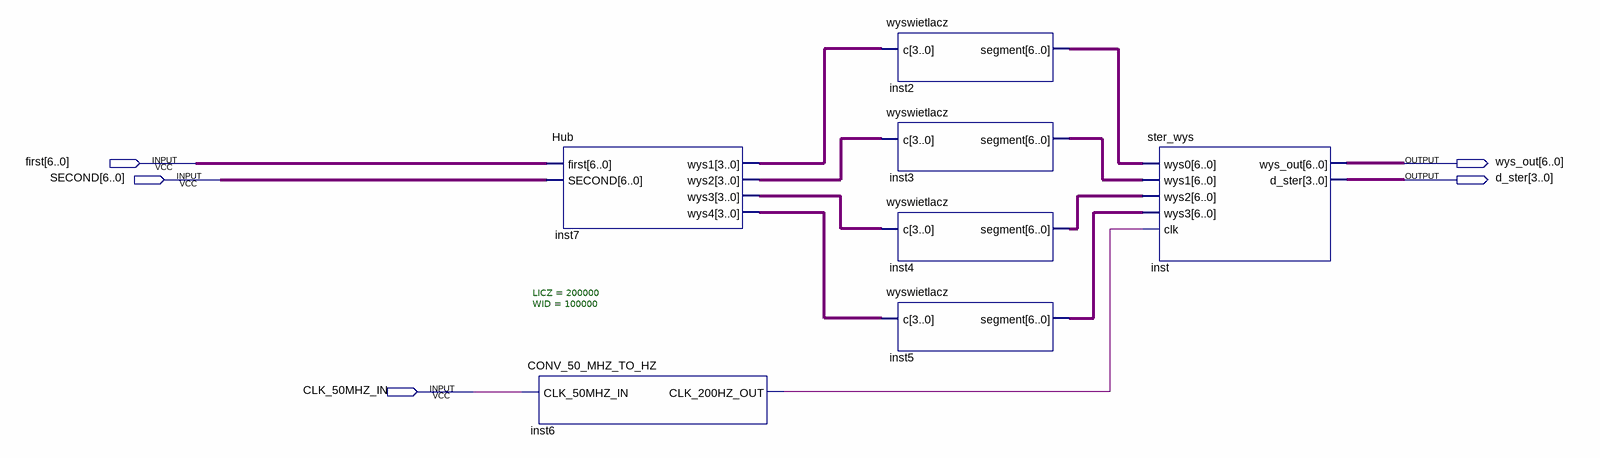
[diagram p0: schematic sheet]
// Quartus schematic seg7Block.bdf as structural Verilog: 7 symbols, 5 pins
module seg7Block (
  input  [6:0] first,
  input  [6:0] SECOND,
  input  CLK_50MHZ_IN,
  output [6:0] wys_out,
  output [3:0] d_ster
);

  wire inst6_clk_200hz_out;
  wire [3:0] inst7_wys1, inst7_wys2, inst7_wys3, inst7_wys4;
  wire [6:0] inst2_segment, inst3_segment, inst4_segment, inst5_segment;

  CONV_50_MHZ_TO_HZ #(.LICZ(200000), .WID(100000)) inst6 (
    .CLK_50MHZ_IN(CLK_50MHZ_IN), .CLK_200HZ_OUT(inst6_clk_200hz_out));
  Hub inst7 (
    .first(first), .SECOND(SECOND), .wys1(inst7_wys1), .wys2(inst7_wys2), .wys3(inst7_wys3), .wys4(inst7_wys4));
  wyswietlacz inst2 (.c(inst7_wys1), .segment(inst2_segment));
  wyswietlacz inst3 (.c(inst7_wys2), .segment(inst3_segment));
  wyswietlacz inst4 (.c(inst7_wys3), .segment(inst4_segment));
  wyswietlacz inst5 (.c(inst7_wys4), .segment(inst5_segment));
  ster_wys inst (
    .wys0(inst2_segment), .wys1(inst3_segment), .wys2(inst4_segment), .wys3(inst5_segment),
    .clk(inst6_clk_200hz_out), .wys_out(wys_out), .d_ster(d_ster));
endmodule
